# EAGLE design X14-Distribution (EAGLE 9.5.0)
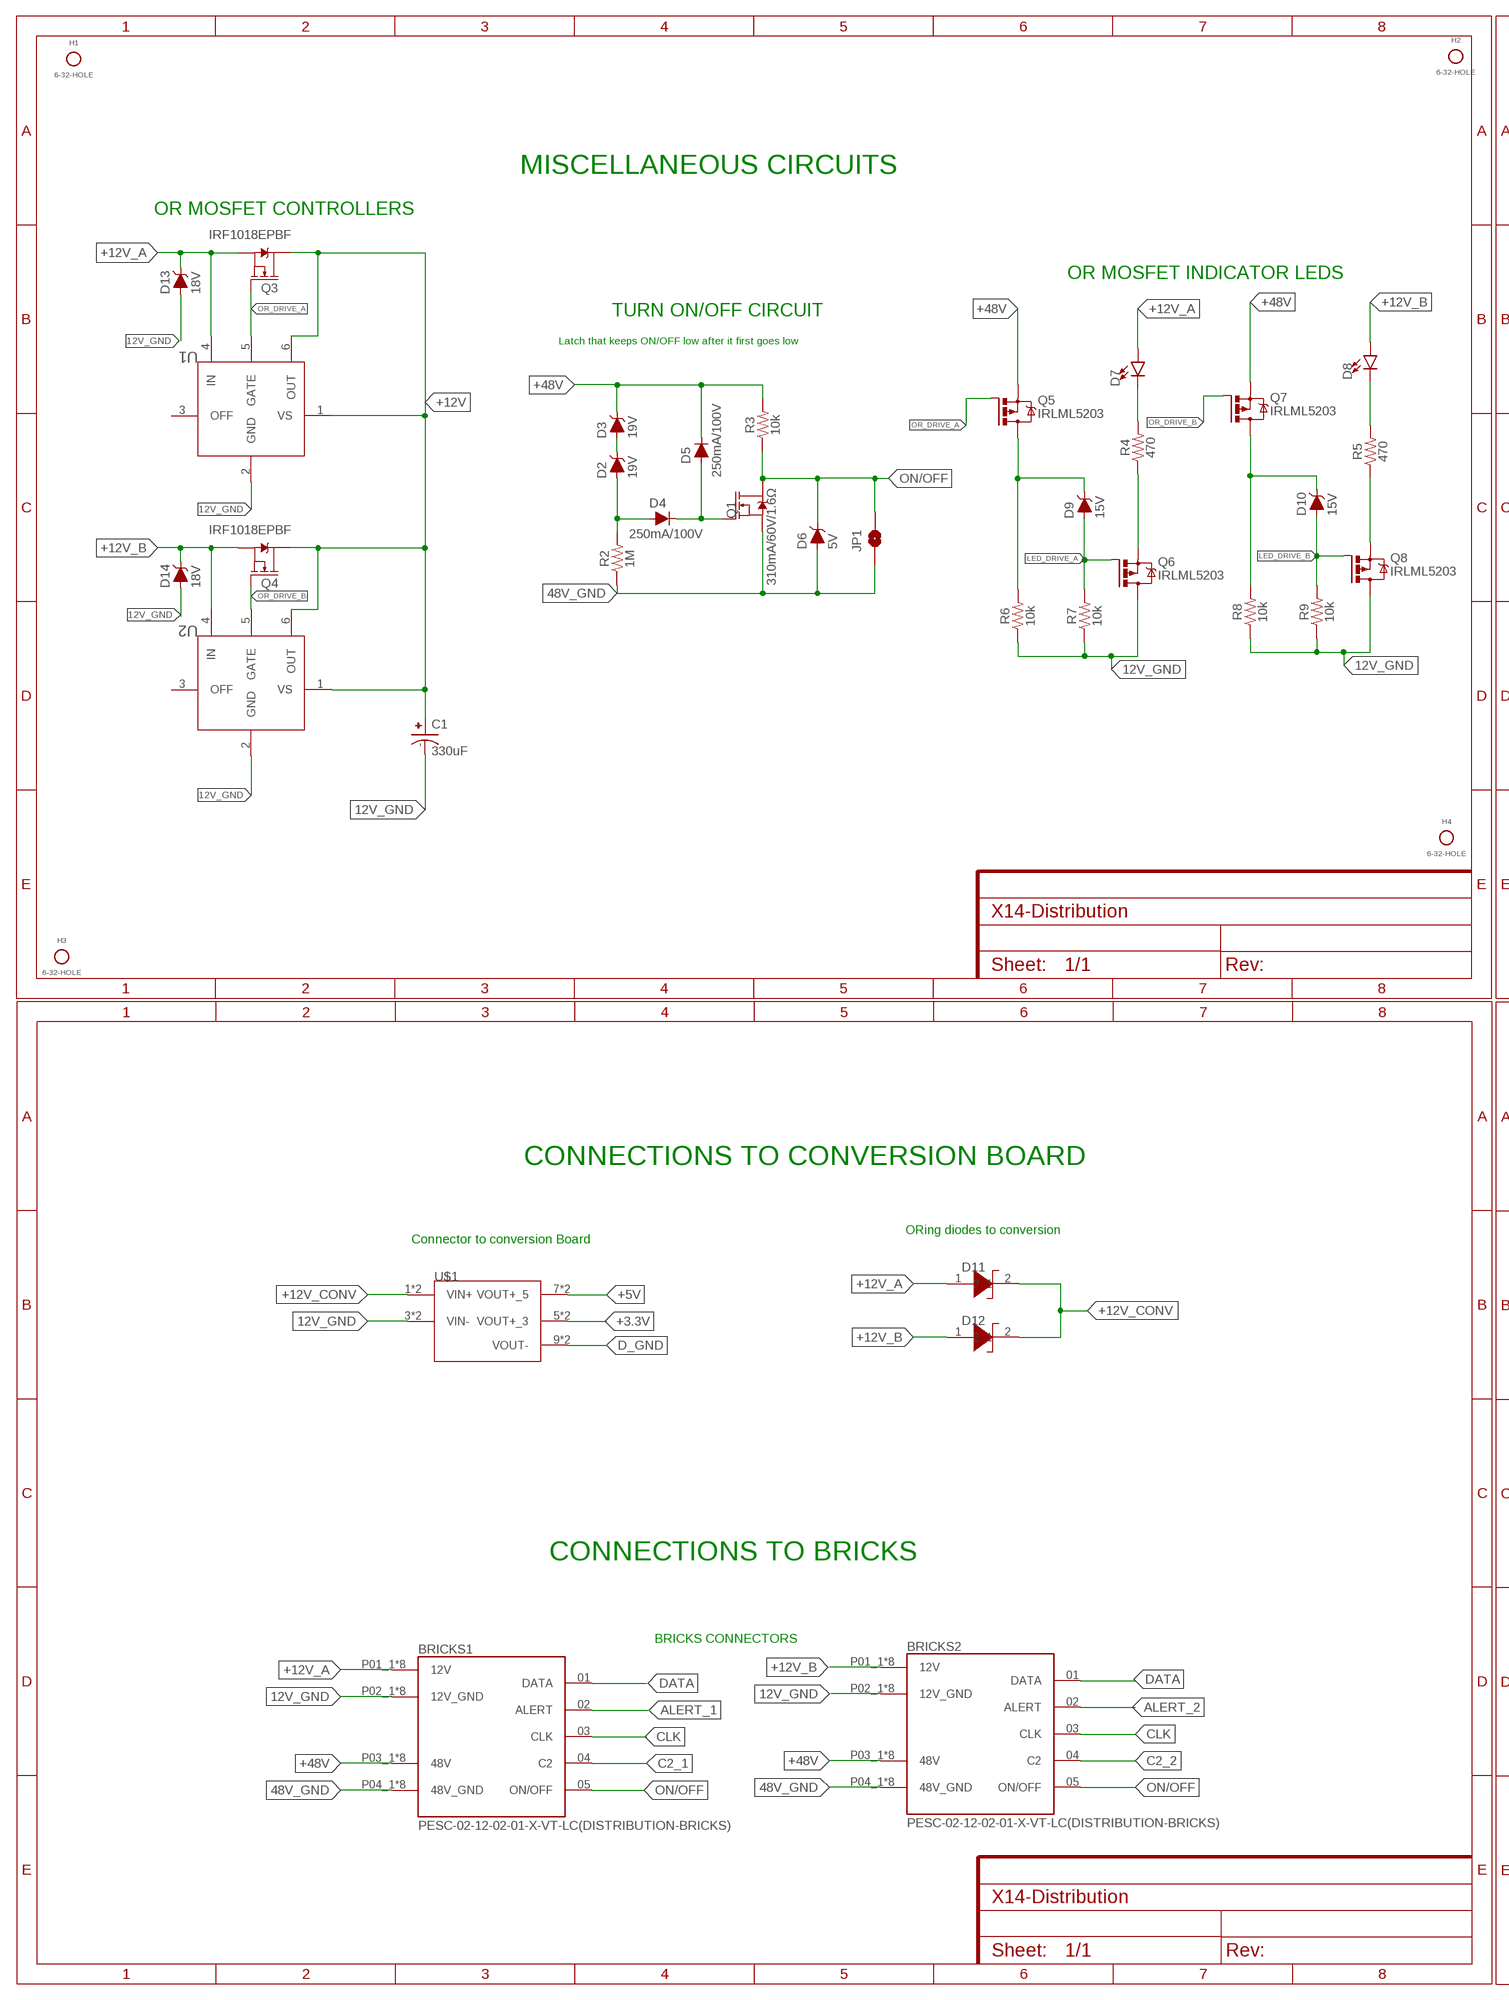
[diagram p0: schematic, sheet 1, part 1 of 2]
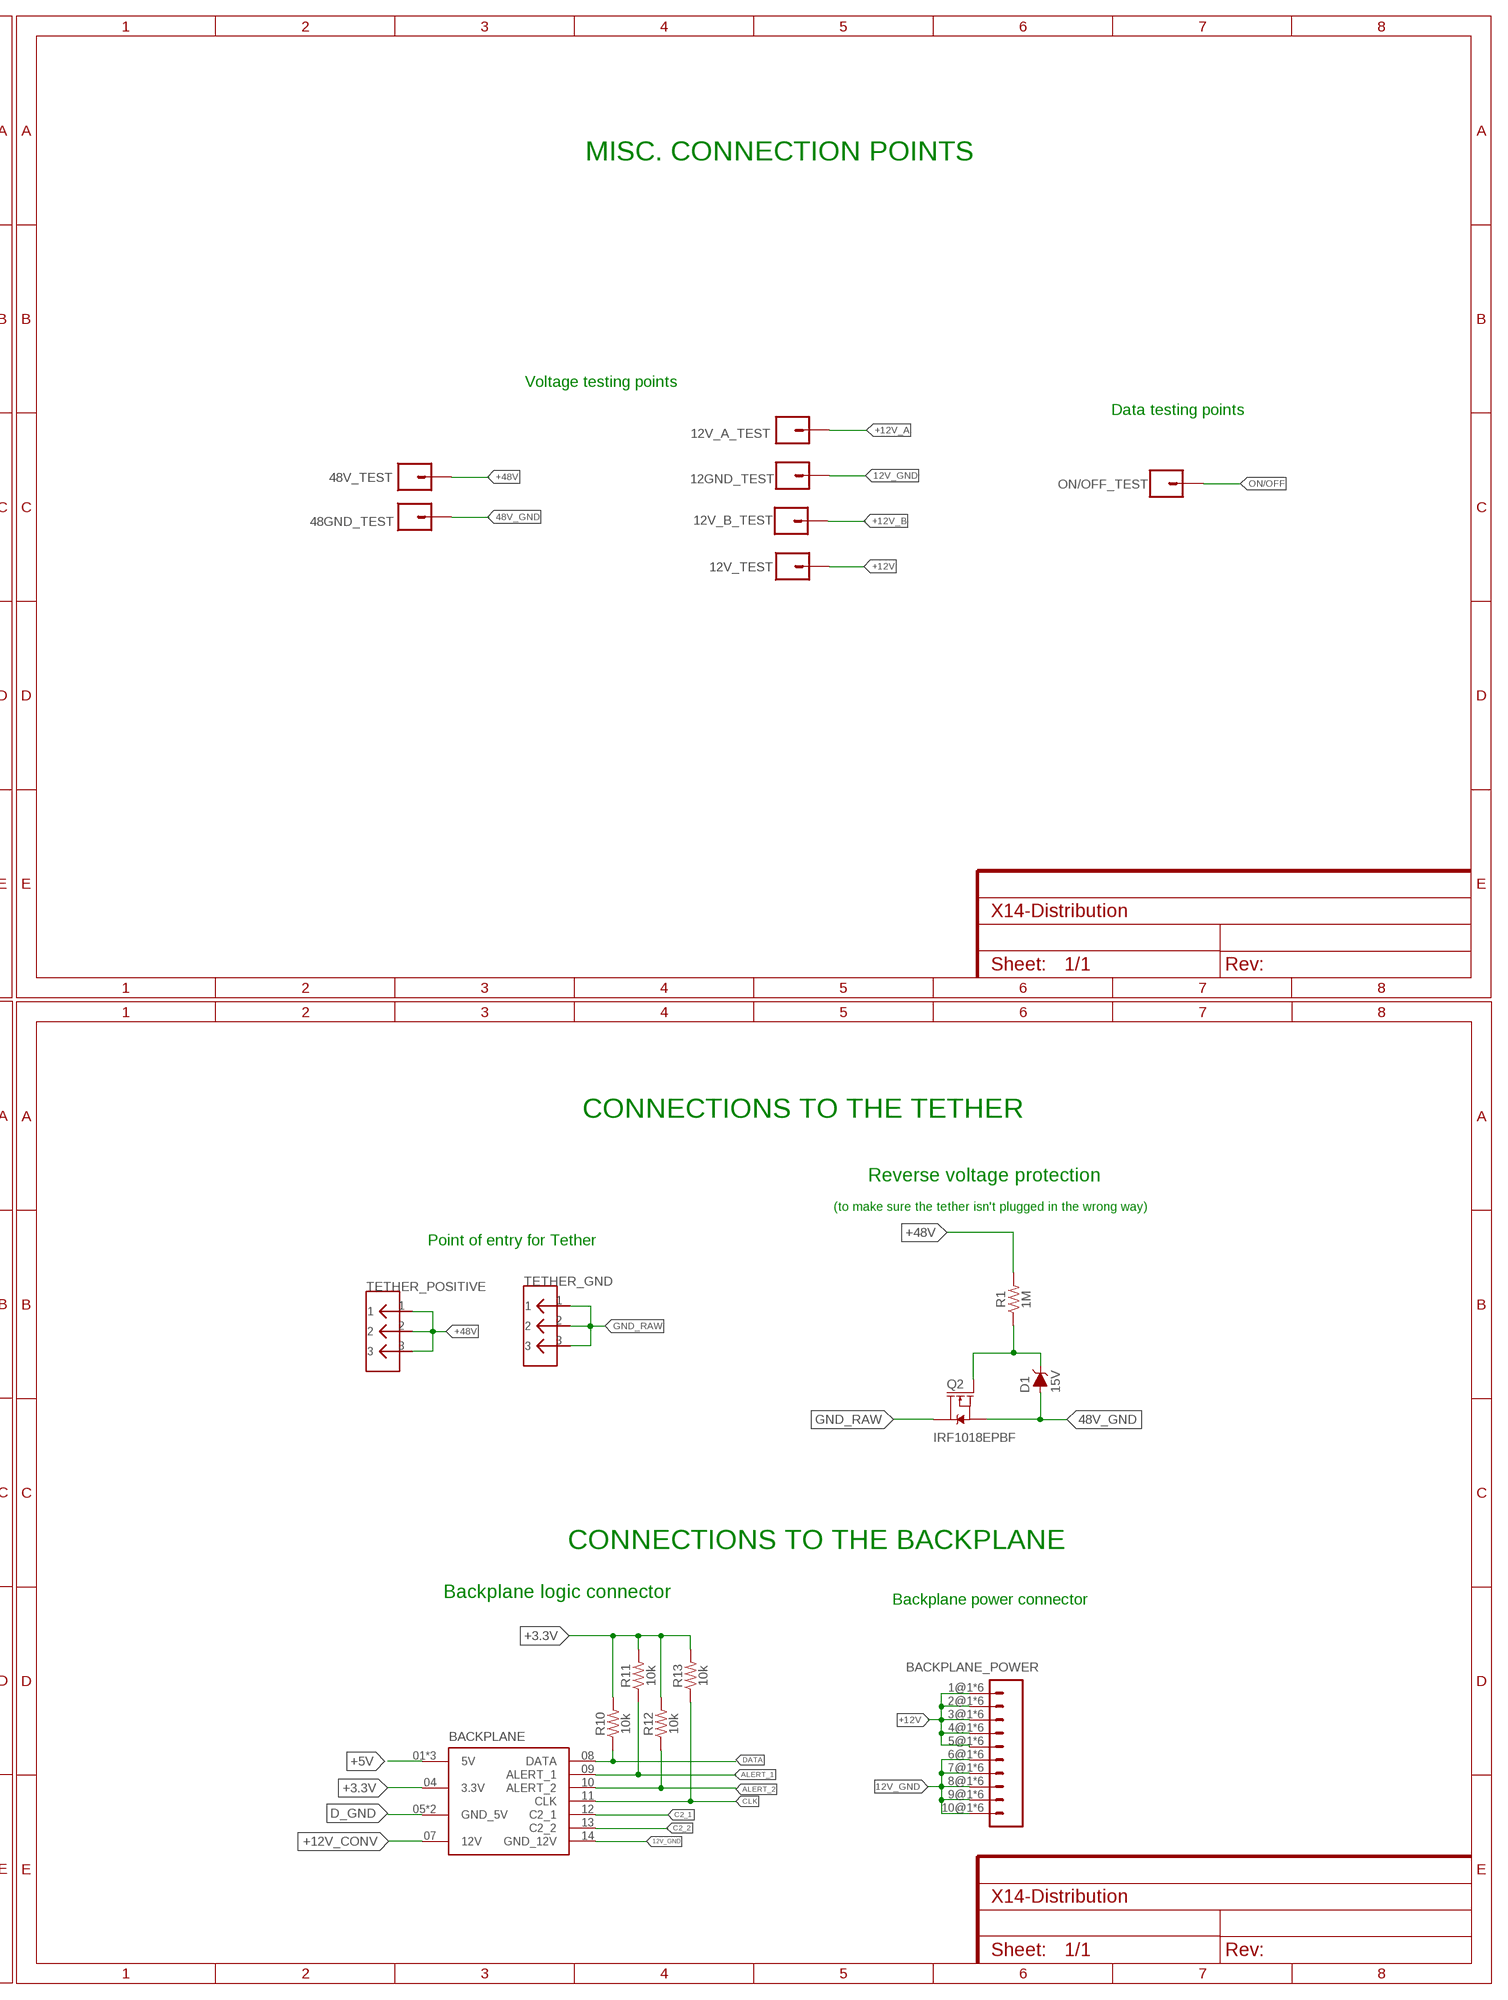
[diagram p1: schematic, sheet 1, part 2 of 2]

## Parts
12GND_TEST  CONN_01  [1X01]
12V_A_TEST  CONN_01  [1X01]
12V_B_TEST  CONN_01  [1X01]
12V_TEST  CONN_01  [1X01]
48GND_TEST  CONN_01  [1X01]
48V_TEST  CONN_01  [1X01]
BACKPLANE  DISTRIBUTION-BACKPLANE  [SAMTEC_IPL1-107-01-X-D-K(D-B)]
BACKPLANE_POWER  MPPT-10-01-01-L-RA-SD  [MPPT-10-01-01-L-RA-SD]
BRICKS1  PESC-02-12-02-01-X-VT-LC(DISTRIBUTION-BRICKS)  [SAMTEC_PESC-02-12-02-01-X-VT-LC(D-B)]
BRICKS2  PESC-02-12-02-01-X-VT-LC(DISTRIBUTION-BRICKS)  [SAMTEC_PESC-02-12-02-01-X-VT-LC(D-B)]
C1  330uF  UCM1H331MNL1GS  [CAPAE1030X1050N]
D1  15V  DIODE-ZENER-BZT52C3V6S  [SOD-323]
D2  19V  DIODE-ZENER-BZT52C3V6S  [SOD-323]
D3  19V  DIODE-ZENER-BZT52C3V6S  [SOD-323]
D4  250mA/100V  DIODE-BAS16J  [SOD-323]
D5  250mA/100V  DIODE-BAS16J  [SOD-323]
D6  5V  DIODE-ZENER-BZT52C3V6S  [SOD-323]
D7  LED0603  [LED-0603]
D8  LED0603  [LED-0603]
D9  15V  DIODE-ZENER-BZT52C3V6S  [SOD-323]
D10  15V  DIODE-ZENER-BZT52C3V6S  [SOD-323]
D11  DIODE-DO-214AC(SK34ATR)  [DIODE-DO-214AC(SK34ATR)]
D12  DIODE-DO-214AC(SK34ATR)  [DIODE-DO-214AC(SK34ATR)]
D13  18V  DIODE-ZENER-DZ2J150M0L  [PANASONIC_SMINI2-F5-B]
D14  18V  DIODE-ZENER-DZ2J150M0L  [PANASONIC_SMINI2-F5-B]
H1  6-32-HOLE  [6-32-HOLE]
H2  6-32-HOLE  [6-32-HOLE]
H3  6-32-HOLE  [6-32-HOLE]
H4  6-32-HOLE  [6-32-HOLE]
JP1  JUMPER-SMT_2_NO_SILK  [SMT-JUMPER_2_NO_SILK]
ON/OFF_TEST  CONN_01  [1X01]
Q1  310mA/60V/1.6Ω  MOSFET-NCH-2N7002PW  [SOT323]
Q2  IRF1018EPBF  [TO263]
Q3  IRF1018EPBF  [TO263]
Q4  IRF1018EPBF  [TO263]
Q5  IRLML5203  PMOSFET_IRLML5203  [SOT23]
Q6  IRLML5203  PMOSFET_IRLML5203  [SOT23]
Q7  IRLML5203  PMOSFET_IRLML5203  [SOT23]
Q8  IRLML5203  PMOSFET_IRLML5203  [SOT23]
R1  1M  RESISTOR0603  [0603]
R2  1M  RESISTOR0603  [0603]
R3  10k  RESISTOR0603  [0603]
R4  470  RESISTOR0603  [0603]
R5  470  RESISTOR0603  [0603]
R6  10k  RESISTOR0603  [0603]
R7  10k  RESISTOR0603  [0603]
R8  10k  RESISTOR0603  [0603]
R9  10k  RESISTOR0603  [0603]
R10  10k  RESISTOR0603  [0603]
R11  10k  RESISTOR0603  [0603]
R12  10k  RESISTOR0603  [0603]
R13  10k  RESISTOR0603  [0603]
TETHER_GND  796636-3  [796636-3]
TETHER_POSITIVE  796636-3  [796636-3]
U1  DIST_OR_CONTROL_ALTMK06A-M  [SOT-23-6]
U2  DIST_OR_CONTROL_ALTMK06A-M  [SOT-23-6]
U$1  DISTRIBUTION-CONVERSION  [TSW-105-05-G-S(D-C)]

## Nets
12V_GND: 12GND_TEST.1 BACKPLANE.14(GND_12V) BACKPLANE_POWER.6@1 BACKPLANE_POWER.6@2 BACKPLANE_POWER.6@3 BACKPLANE_POWER.6@4 BACKPLANE_POWER.6@5 BACKPLANE_POWER.6@6 BACKPLANE_POWER.7@1 BACKPLANE_POWER.7@2 BACKPLANE_POWER.7@3 BACKPLANE_POWER.7@4 BACKPLANE_POWER.7@5 BACKPLANE_POWER.7@6 BACKPLANE_POWER.8@1 BACKPLANE_POWER.8@2 BACKPLANE_POWER.8@3 BACKPLANE_POWER.8@4 BACKPLANE_POWER.8@5 BACKPLANE_POWER.8@6 BACKPLANE_POWER.9@1 BACKPLANE_POWER.9@2 BACKPLANE_POWER.9@3 BACKPLANE_POWER.9@4 BACKPLANE_POWER.9@5 BACKPLANE_POWER.9@6 BACKPLANE_POWER.10@1 BACKPLANE_POWER.10@2 BACKPLANE_POWER.10@3 BACKPLANE_POWER.10@4 BACKPLANE_POWER.10@5 BACKPLANE_POWER.10@6 BRICKS1.P02_1(12V_GND) BRICKS1.P02_2(12V_GND) BRICKS1.P02_3(12V_GND) BRICKS1.P02_4(12V_GND) BRICKS1.P02_5(12V_GND) BRICKS1.P02_6(12V_GND) BRICKS1.P02_7(12V_GND) BRICKS1.P02_8(12V_GND) BRICKS2.P02_1(12V_GND) BRICKS2.P02_2(12V_GND) BRICKS2.P02_3(12V_GND) BRICKS2.P02_4(12V_GND) BRICKS2.P02_5(12V_GND) BRICKS2.P02_6(12V_GND) BRICKS2.P02_7(12V_GND) BRICKS2.P02_8(12V_GND) C1.- D13.A D14.A Q6.3(D) Q8.3(D) R6.1 R7.1 R8.1 R9.1 U1.2(GND) U2.2(GND) U$1.3(VIN-) U$1.4(VIN-)
48V_GND: 48GND_TEST.1 BRICKS1.P04_1(48V_GND) BRICKS1.P04_2(48V_GND) BRICKS1.P04_3(48V_GND) BRICKS1.P04_4(48V_GND) BRICKS1.P04_5(48V_GND) BRICKS1.P04_6(48V_GND) BRICKS1.P04_7(48V_GND) BRICKS1.P04_8(48V_GND) BRICKS2.P04_1(48V_GND) BRICKS2.P04_2(48V_GND) BRICKS2.P04_3(48V_GND) BRICKS2.P04_4(48V_GND) BRICKS2.P04_5(48V_GND) BRICKS2.P04_6(48V_GND) BRICKS2.P04_7(48V_GND) BRICKS2.P04_8(48V_GND) D1.A D6.A JP1.1 Q1.2(S) Q2.2(S) R2.1
+3.3V: BACKPLANE.04(3.3V) R10.2 R11.2 R12.2 R13.2 U$1.5(VOUT+_3) U$1.6(VOUT+_3)
+5V: BACKPLANE.01(5V) BACKPLANE.02(5V) BACKPLANE.03(5V) U$1.7(VOUT+_5) U$1.8(VOUT+_5)
+12V: 12V_TEST.1 BACKPLANE_POWER.1@1 BACKPLANE_POWER.1@2 BACKPLANE_POWER.1@3 BACKPLANE_POWER.1@4 BACKPLANE_POWER.1@5 BACKPLANE_POWER.1@6 BACKPLANE_POWER.2@1 BACKPLANE_POWER.2@2 BACKPLANE_POWER.2@3 BACKPLANE_POWER.2@4 BACKPLANE_POWER.2@5 BACKPLANE_POWER.2@6 BACKPLANE_POWER.3@1 BACKPLANE_POWER.3@2 BACKPLANE_POWER.3@3 BACKPLANE_POWER.3@4 BACKPLANE_POWER.3@5 BACKPLANE_POWER.3@6 BACKPLANE_POWER.4@1 BACKPLANE_POWER.4@2 BACKPLANE_POWER.4@3 BACKPLANE_POWER.4@4 BACKPLANE_POWER.4@5 BACKPLANE_POWER.4@6 BACKPLANE_POWER.5@1 BACKPLANE_POWER.5@2 BACKPLANE_POWER.5@3 BACKPLANE_POWER.5@4 BACKPLANE_POWER.5@5 BACKPLANE_POWER.5@6 C1.+ Q3.3(D) Q4.3(D) U1.1(VS) U1.6(OUT) U2.1(VS) U2.6(OUT)
+12V_A: 12V_A_TEST.1 BRICKS1.P01_1(12V) BRICKS1.P01_2(12V) BRICKS1.P01_3(12V) BRICKS1.P01_4(12V) BRICKS1.P01_5(12V) BRICKS1.P01_6(12V) BRICKS1.P01_7(12V) BRICKS1.P01_8(12V) D7.A D11.1 D13.C Q3.2(S) U1.4(IN)
+12V_B: 12V_B_TEST.1 BRICKS2.P01_1(12V) BRICKS2.P01_2(12V) BRICKS2.P01_3(12V) BRICKS2.P01_4(12V) BRICKS2.P01_5(12V) BRICKS2.P01_6(12V) BRICKS2.P01_7(12V) BRICKS2.P01_8(12V) D8.A D12.1 D14.C Q4.2(S) U2.4(IN)
+12V_CONV: BACKPLANE.07(12V) D11.2 D12.2 U$1.1(VIN+) U$1.2(VIN+)
+48V: 48V_TEST.1 BRICKS1.P03_1(48V) BRICKS1.P03_2(48V) BRICKS1.P03_3(48V) BRICKS1.P03_4(48V) BRICKS1.P03_5(48V) BRICKS1.P03_6(48V) BRICKS1.P03_7(48V) BRICKS1.P03_8(48V) BRICKS2.P03_1(48V) BRICKS2.P03_2(48V) BRICKS2.P03_3(48V) BRICKS2.P03_4(48V) BRICKS2.P03_5(48V) BRICKS2.P03_6(48V) BRICKS2.P03_7(48V) BRICKS2.P03_8(48V) D3.C D5.C Q5.2(S) Q7.2(S) R1.2 R3.2 TETHER_POSITIVE.1 TETHER_POSITIVE.2 TETHER_POSITIVE.3
ALERT_1: BACKPLANE.09(ALERT_1) BRICKS1.02(ALERT) R11.1
ALERT_2: BACKPLANE.10(ALERT_2) BRICKS2.02(ALERT) R12.1
C2_1: BACKPLANE.12(C2_1) BRICKS1.04(C2)
C2_2: BACKPLANE.13(C2_2) BRICKS2.04(C2)
CLK: BACKPLANE.11(CLK) BRICKS1.03(CLK) BRICKS2.03(CLK) R13.1
D_GND: BACKPLANE.05(GND_5V) BACKPLANE.06(GND_5V) U$1.9(VOUT-) U$1.10(VOUT-)
DATA: BACKPLANE.08(DATA) BRICKS1.01(DATA) BRICKS2.01(DATA) R10.1
GND_RAW: Q2.3(D) TETHER_GND.1 TETHER_GND.2 TETHER_GND.3
LED_DRIVE_A: D9.A Q6.1(G) R7.2
LED_DRIVE_B: D10.A Q8.1(G) R9.2
N$1: D1.C Q2.1(G) R1.1
N$2: D4.C D5.A Q1.1(G)
N$3: Q6.2(S) R4.1
N$4: D2.C D3.A
N$5: D9.C Q5.3(D) R6.2
N$6: D2.A D4.A R2.2
N$7: Q8.2(S) R5.1
N$11: D10.C Q7.3(D) R8.2
N$13: D7.C R4.2
N$15: D8.C R5.2
ON/OFF: BRICKS1.05(ON/OFF) BRICKS2.05(ON/OFF) D6.C JP1.2 ON/OFF_TEST.1 Q1.3(D) R3.1
OR_DRIVE_A: Q3.1(G) Q5.1(G) U1.5(GATE)
OR_DRIVE_B: Q4.1(G) Q7.1(G) U2.5(GATE)
Unconnected: U1.3(OFF) U2.3(OFF)

## Notes on the sheet
- MISC. CONNECTION POINTS
- MISCELLANEOUS CIRCUITS
- OR MOSFET CONTROLLERS
- OR MOSFET INDICATOR LEDS
- TURN ON/OFF CIRCUIT
- Latch that keeps ON/OFF low after it first goes low
- Voltage testing points
- Data testing points
- CONNECTIONS TO THE TETHER
- CONNECTIONS TO CONVERSION BOARD
- Reverse voltage protection
- (to make sure the tether isn't plugged in the wrong way)
- ORing diodes to conversion
- Connector to conversion Board | Point of entry for Tether
- CONNECTIONS TO THE BACKPLANE
- CONNECTIONS TO BRICKS
- Backplane logic connector
- Backplane power connector
- BRICKS CONNECTORS

## Library data of the parts
12GND_TEST 12V_A_TEST 12V_B_TEST 12V_TEST 48GND_TEST 48V_TEST ON/OFF_TEST = SparkFun-Connectors:CONN_01: Single connection point. Often used as Generic Header-pin footprint for 0.1 inch spaced/style header connections On any of the 0.1 inch spaced packages, you can populate with these: Break Away Headers - Straight <https://www.sparkfun.com/products/116> (PRT-00116) Break Away Male Headers - Right Angle <https://www.sparkfun.com/products/553> (PRT-00553) Female Headers <https://www.sparkfun.com/products/115> (PRT-00115) Break Away Headers - Machine Pin <https://www.sparkfun.com/products/117> (PRT-00117) Break Away Female Headers - Swiss Machine Pin <https://www.sparkfun.com/products/743> (PRT-00743) This device is also useful as a general connection point to wire up your design to another part of your project. Our various solder wires solder well into these plated through hole pads. Hook-Up Wire - Assortment (Stranded, 22 AWG) <https://www.sparkfun.com/products/11375> (PRT-11375) Hook-Up Wire - Assortment (Solid Core, 22 AWG) <https://www.sparkfun.com/products/11367> (PRT-11367) View the entire wire category on our website here <https://www.sparkfun.com/categories/141> Special notes: SMTSO-256-ET is a "flush mount" nut for a 4-40 screw. We mostly use this on specialty testbeds; it is a nice way to connect hardware to your PCB at an adjustable hieght. Also note, the SNAP packages are for using a snappable style connector. We sell a baggie of snaps and they are also used on two LilyPad designs: Snap Assortment - 30 pack (male and female) <https://www.sparkfun.com/products/11347> (DEV-11347) LilyPad Arduino SimpleSnap <https://www.sparkfun.com/products/10941> (DEV-10941) LilyPad SimpleSnap Protoboard <https://www.sparkfun.com/products/10940> (DEV-10940)
BACKPLANE = CONN, Distribution-Backplane:DISTRIBUTION-BACKPLANE
BACKPLANE_POWER = CONN, Samtec MPPT Hermaphoditic 10 pos - MPPT-10-01-01-L-RA-SD:MPPT-10-01-01-L-RA-SD: Samtec MPPT Connector Right Angle Vertically mating Non-gendered https://www.samtec.com/products/mppt-10-01-01-l-ra-sd
BRICKS1 BRICKS2 = CONN, Distribution-Bricks:PESC-02-12-02-01-X-VT-LC(DISTRIBUTION-BRICKS): 16 (12 + 4 Power) Position Receptacle Connector Through Hole Gold; MANUFACTURER: Samtec; MAXIMUM_PACKAGE_HEIGHT: 17.04mm; PARTREV: B; STANDARD: Manufacturer Recommendations
C1 = CAP, aluminin-capacitor-brick-UCM1H331MNL1GS:UCM1H331MNL1GS: Nichicon 330uF 50 V Aluminium Electrolytic Capacitor SMD, CM Series 2000h 10 (Dia.) x 10mm Source: Datasheet <http://www.nichicon.co.jp/english/products/pdfs/e-ucm.pdf>; ARROW_PART_NUMBER: UCM1H331MNL1GS; ARROW_PRICE-STOCK: https://www.arrow.com/en/products/ucm1h331mnl1gs/nichicon; DESCRIPTION: Nichicon 330uF 50 V Aluminium Electrolytic Capacitor SMD, CM Series 2000h 10 (Dia.) x 10mm; HEIGHT: 10.5mm; MANUFACTURER_NAME: Nichicon; MANUFACTURER_PART_NUMBER: UCM1H331MNL1GS; MOUSER_PART_NUMBER: 647-UCM1H331MNL1GS; MOUSER_PRICE-STOCK: https://www.mouser.co.uk/ProductDetail/Nichicon/UCM1H331MNL1GS?qs=DSgADHjnLTkTovFLdbC%252BNg%3D%3D
D1-D3 D6 D9 D10 = SparkFun-DiscreteSemi:DIODE-ZENER: Zener Diode A Zener diode allows current to flow from its anode to its cathode like a normal semiconductor diode, but it also permits current to flow in the reverse direction when its "Zener voltage" is reached. - WIkipedia; PROD_ID: DIO-08199; VALUE: 3.6V
D4 D5 = SparkFun-DiscreteSemi:DIODE: Diode These are standard reverse protection diodes and small signal diodes. SparkFun Products: SparkFun SparkPunk Sound Kit <https://www.sparkfun.com/products/11177> SparkFun ESP8266 Thing <https://www.sparkfun.com/products/13231>; PROD_ID: DIO-09646
D7 D8 = SparkFun-LED:LED: LED (Generic) Standard schematic elements and footprints for 5mm, 3mm, 1206, and 0603 sized LEDs. Generic LEDs with no color specified.
D11 D12 = DIODE, Dist Oring Schottky Diode:DIODE-DO-214AC(SK34ATR)
D13 D14 = SparkFun-DiscreteSemi:DIODE-ZENER: Zener Diode A Zener diode allows current to flow from its anode to its cathode like a normal semiconductor diode, but it also permits current to flow in the reverse direction when its "Zener voltage" is reached. - WIkipedia; PROD_ID: DIO-12989; VALUE: 15V
H1-H4 = OTHER, Mounting Holes:6-32-HOLE
JP1 = SparkFun-Jumpers:JUMPER-SMT_2_NO: Normally open jumper This jumper has two pads in close proximity to each other. Apply solder to close the connection. Round pads are easier to solder for beginners, but are a lot larger. SparkFun Product that uses the round pads: SparkFun EL Sequencer <https://www.sparkfun.com/products/12781>
Q1 = SparkFun-DiscreteSemi:MOSFET-NCH: N-channel MOSFETs Voltage controlled devices that allow control of high current outputs. SparkFun Products: SparkFun OpenScale <https://www.sparkfun.com/products/13261> SparkFun Digital Sandbox <https://www.sparkfun.com/products/12651> SparkFun Monster Moto Shield <https://www.sparkfun.com/products/10182> SparkFun MOSFET Power Controller <https://www.sparkfun.com/products/11214>; PROD_ID: TRANS-11151
Q2-Q4 = TRANS, Dist_Reverse_Voltage_NMOS:IRF1018EPBF
Q5-Q8 = Transistor:PMOSFET_: P-Channel MOSFET - Popular parts; CATEGORY: Transistor; DESCRIPTION: MOSFET P-CH 30V 3A SOT-23; DRAIN_CURRENT: 3A; MANUFACTURER: Infineon Technologies; MPN: IRLML5203TRPBF; OPERATING_TEMP: -55°C ~ 150°C; PART_STATUS: Active; ROHS_COMPLIANT: Yes; SUB-CATEGORY: MOSFET; THERMALLOSS: 1.25W; TYPE: P-Channel
R1-R13 = SparkFun-Resistors:RESISTOR: Generic Resistor Package
TETHER_GND TETHER_POSITIVE = CONN, 3 pin connection to tether:796636-3
U1 U2 = IC, Dist_OR_Controller:DIST_OR_CONTROL_ALT; BASEPN: LM5050-1; DATASHEETURL: http://www.ti.com/lit/ds/symlink/lm5050-1.pdf; DESCRIPTION: High Side OR-ing FET Controller; MANUFACTURER: Texas Instruments; MANUFACTURER_PART_NUMBER: LM5050MK-1/NOPB; NSC_PACKAGEREFERENCE: MK06A; VENDOR: Texas Instruments
U$1 = CONN, Distribution-Conversion:DISTRIBUTION-CONVERSION

## Board
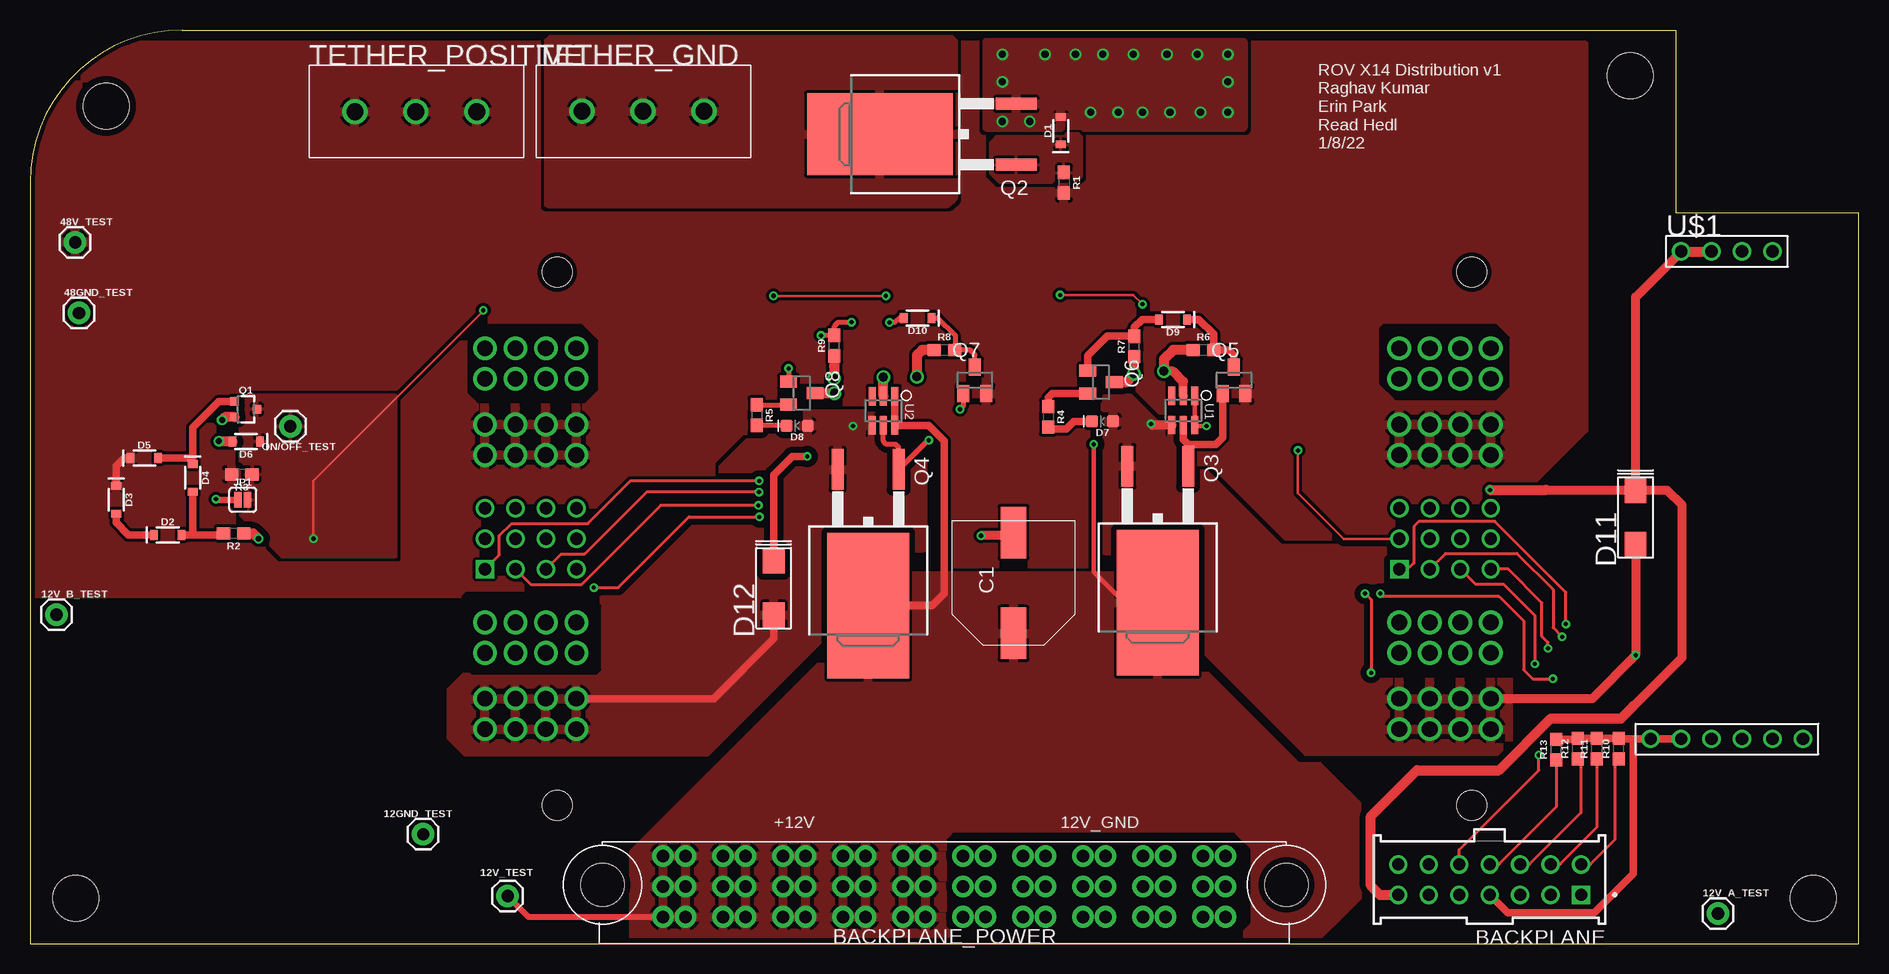
[diagram p2: board, top side]
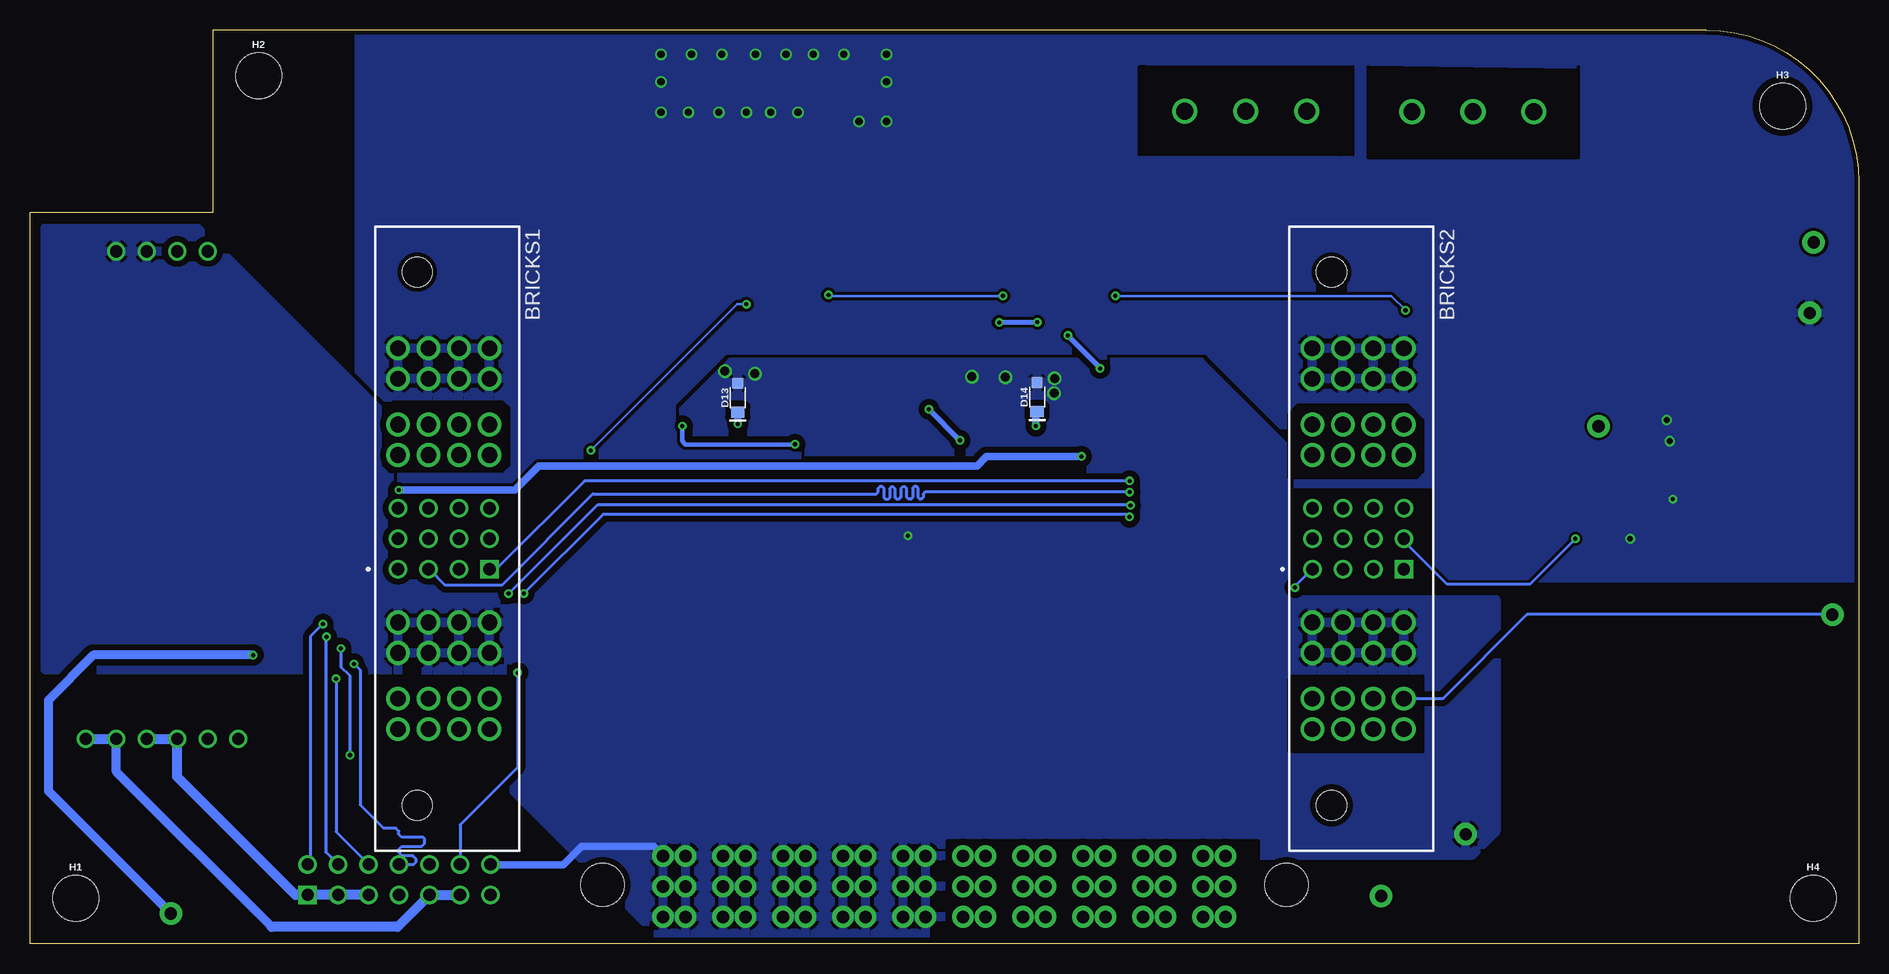
[diagram p3: board, bottom side, seen from below]

Size 152.4 x 76.2 mm. Coordinates in mm from the lower left corner, seen from the top.
Outline: 0,0 152.4,0 152.4,60.96 137.16,60.96 137.16,76.2 12.7,76.2 arc90 0,63.5 0,0
Copper layers (1*16): Top 0.0356mm / dielectric 1.5011mm / Bottom 0.0356mm
Design rules "ECE_Senior_Design": minimum track width 8mil, minimum drill 13mil, track to track 8mil, track to pad 8mil, pad to pad 6mil, via to via 8mil, smd to smd 6mil, copper to edge 15mil, drill to drill 8mil, minimum pad ring 7mil, minimum via ring 7mil, stop-mask expansion 3mil, vias tented up to drill 0mil, thermal gap 10mil

### Footprints (pad centres in the part's own frame; a part is rotated, then mirrored left to right if it is on the bottom)
1X01 = drill 1.016 pad 1.88: 1 0,0
SAMTEC_IPL1-107-01-X-D-K(D-B) = drill 1.02 square: 01 -7.62,1.27 | drill 1.02: 02 -5.08,1.27; 03 -2.54,1.27; 04 0,1.27; 05 2.54,1.27; 06 5.08,1.27; 07 7.62,1.27; 08 -7.62,-1.27; 09 -5.08,-1.27; 10 -2.54,-1.27; 11 0,-1.27; 12 2.54,-1.27; 13 5.08,-1.27; 14 7.62,-1.27
MPPT-10-01-01-L-RA-SD = drill 1.04 pad 1.8: 1@1 -23.44,2.26; 1@2 -21.56,2.26; 1@3 -23.44,4.8; 1@4 -21.56,4.8; 1@5 -23.44,7.34; 1@6 -21.56,7.34; 2@1 -18.44,2.26; 2@2 -16.56,2.26; 2@3 -18.44,4.8; 2@4 -16.56,4.8; 2@5 -18.44,7.34; 2@6 -16.56,7.34; 3@1 -13.44,2.26; 3@2 -11.56,2.26; 3@3 -13.44,4.8; 3@4 -11.56,4.8; 3@5 -13.44,7.34; 3@6 -11.56,7.34; 4@1 -8.44,2.26; 4@2 -6.56,2.26; 4@3 -8.44,4.8; 4@4 -6.56,4.8; 4@5 -8.44,7.34; 4@6 -6.56,7.34; 5@1 -3.44,2.26; 5@2 -1.56,2.26; 5@3 -3.44,4.8; 5@4 -1.56,4.8; 5@5 -3.44,7.34; 5@6 -1.56,7.34; 6@1 1.56,2.26; 6@2 3.44,2.26; 6@3 1.56,4.8; 6@4 3.44,4.8; 6@5 1.56,7.34; 6@6 3.44,7.34; 7@1 6.56,2.26; 7@2 8.44,2.26; 7@3 6.56,4.8; 7@4 8.44,4.8; 7@5 6.56,7.34; 7@6 8.44,7.34; 8@1 11.56,2.26; 8@2 13.44,2.26; 8@3 11.56,4.8; 8@4 13.44,4.8; 8@5 11.56,7.34; 8@6 13.44,7.34; 9@1 16.56,2.26; 9@2 18.44,2.26; 9@3 16.56,4.8; 9@4 18.44,4.8; 9@5 16.56,7.34; 9@6 18.44,7.34; 10@1 21.56,2.26; 10@2 23.44,2.26; 10@3 21.56,4.8; 10@4 23.44,4.8; 10@5 21.56,7.34; 10@6 23.44,7.34 | hole 3.6: 28.5,4.93; -28.5,4.93
SAMTEC_PESC-02-12-02-01-X-VT-LC(D-B) = drill 1.02 square: 01 2.54,6.03 | drill 1.02: 02 2.54,3.49; 03 2.54,0.95; 04 2.54,-1.59; 05 0,6.03; 06 0,3.49; 07 0,0.95; 08 0,-1.59; 09 -2.54,6.03; 10 -2.54,3.49; 11 -2.54,0.95; 12 -2.54,-1.59 | drill 1.32: P01_1 15.875,-1.59; P01_2 15.875,0.95; P01_3 15.875,3.49; P01_4 15.875,6.03; P01_5 13.335,-1.59; P01_6 13.335,0.95; P01_7 13.335,3.49; P01_8 13.335,6.03; P02_1 9.525,-1.59; P02_2 9.525,0.95; P02_3 9.525,3.49; P02_4 9.525,6.03; P02_5 6.985,-1.59; P02_6 6.985,0.95; P02_7 6.985,3.49; P02_8 6.985,6.03; P03_1 -6.985,-1.59; P03_2 -6.985,0.95; P03_3 -6.985,3.49; P03_4 -6.985,6.03; P03_5 -9.525,-1.59; P03_6 -9.525,0.95; P03_7 -9.525,3.49; P03_8 -9.525,6.03; P04_1 -13.335,-1.59; P04_2 -13.335,0.95; P04_3 -13.335,3.49; P04_4 -13.335,6.03; P04_5 -15.875,-1.59; P04_6 -15.875,0.95; P04_7 -15.875,3.49; P04_8 -15.875,6.03 | hole 2.49: -22.225,0; 22.225,0
CAPAE1030X1050N = smd 4.3 x 2.15: + -4.2,0; - 4.2,0
SOD-323 = smd 0.63 x 0.83: A 1.15,0; C -1.15,0
LED-0603 = smd 1 x 1: A -0.877,0; C 0.877,0
DIODE-DO-214AC(SK34ATR) = smd 2.1 x 1.8: 1 -2.3,0; 2 2.2,0
PANASONIC_SMINI2-F5-B = smd 0.9 x 0.9: A 1.2,0 | smd 0.9 x 1.1: C -1.2,0
6-32-HOLE = hole 3.81: 0,0
SMT-JUMPER_2_NO_SILK = smd 0.635 x 1.27: 1 -0.406,0; 2 0.406,0
SOT323 = smd 0.7 x 0.7: 1 -0.65,-0.925; 2 0.65,-0.925; 3 0,0.925
TO263 = smd 3.4 x 1: 1 -6.552,2.54; 2 -6.552,-2.54 | smd 12.14 x 6.8: 3 4.818,0
SOT23 = smd 1 x 1.4: 1 -0.95,-1.1; 2 0.95,-1.1; 3 0,1.1
0603 = smd 1.1 x 1: 1 -0.85,0; 2 0.85,0
796636-3 = drill 1.4: 1 -5.08,0; 2 0,0; 3 5.08,0
SOT-23-6 = smd 1.524 x 0.584: 1 -1.219,0.95; 2 -1.219,0; 3 -1.219,-0.95; 4 1.219,-0.95; 5 1.219,0; 6 1.219,0.95
TSW-105-05-G-S(D-C) = drill 1.016: 1 -3.81,20.32; 2 -1.27,20.32; 3 1.27,20.32; 4 3.81,20.32; 5 -6.35,-20.32; 6 -3.81,-20.32; 7 -1.27,-20.32; 8 1.27,-20.32; 9 3.81,-20.32; 10 6.35,-20.32

### Placement (x,y rotation side)
12GND_TEST  32.77,9.14 0 top
12V_A_TEST  140.67,2.54 0 top
12V_B_TEST  2.21,27.46 0 top
12V_TEST  39.8,3.99 0 top
48GND_TEST  4.09,52.6 0 top
48V_TEST  3.76,58.5 0 top
BACKPLANE  121.64,5.36 180 top
BACKPLANE_POWER  76.2,0 0 top
BRICKS1  120.14,33.78 270 bottom
BRICKS2  43.94,33.78 270 bottom
C1  81.97,30.1 90 top
D1  85.9,67.79 90 top
D2  11.48,34.11 0 top
D3  7.19,37.03 270 top
D4  13.56,38.86 270 top
D5  9.53,40.51 0 top
D6  18.01,41.88 180 top
D7  89.38,43.56 180 top
D8  63.93,43.21 180 top
D9  95.25,52.07 180 top
D10  73.96,52.2 180 top
D11  133.81,35.61 90 top
D12  61.98,29.72 90 top
D13  93.42,45.54 90 bottom
D14  68.48,45.59 90 bottom
H1  148.59,3.81 0 bottom
H2  133.35,72.39 0 bottom
H3  6.35,69.85 0 bottom
H4  3.81,3.81 0 bottom
JP1  17.73,37.03 0 top
ON/OFF_TEST  21.69,43.15 180 top
Q1  17.98,44.58 270 top
Q2  75.64,67.51 180 top
Q3  93.98,33.27 270 top
Q4  69.85,33.02 270 top
Q5  100.33,46.99 0 top
Q6  89.26,46.84 270 top
Q7  78.74,46.99 0 top
Q8  64.31,45.92 270 top
R1  86.16,63.47 270 top
R2  16.97,34.24 180 top
R3  17.65,39.14 180 top
R4  84.84,43.94 270 top
R5  60.55,44.09 270 top
R6  97.79,49.53 0 top
R7  92.02,49.81 90 top
R8  76.2,49.53 0 top
R9  67.03,49.89 90 top
R10  132.41,16.28 90 top
R11  130.58,16.28 90 top
R12  128.98,16.28 90 top
R13  127.2,16.21 90 top
TETHER_GND  51.08,69.42 0 top
TETHER_POSITIVE  32.16,69.39 0 top
U1  96.11,44.48 270 top
U2  71.12,44.45 270 top
U$1  141.4,37.41 0 top

### Tracks (layer width: path | path; a pad name or v marks a point on that pad's centre or on a via)
12V_GND  (via drill 0.35, 0.75)
  Top 0.61: 67.03,48.18 67,48.16
  Top 0.762: C1.- 81.7,34.04 v79.25,34.04 | U1.2 96.11,46.89 95.25,47.75 v94.49,47.75
  Top 0.813: Q8.3 v67.06,45.92 | R9.1 67.03,48.18 | 67,48.16 v67,47.14 | R8.1 74.33,49.53 73.91,49.11 v73.91,47.3 | U2.2 v71.12,47.24 | R7.1 92,48.93 v92,47.55 92,47.5 91.34,46.84 Q6.3 | R6.1 95.25,49.53 94.49,48.77 v94.49,47.75
  Bottom 0.61: BACKPLANE.14 114,6.6 107.95,6.6 106.43,8.13 100.43,8.13 BACKPLANE_POWER.10@6
  pour Bottom (isolate 0.508, rank 3): 30.23,28.7 30.23,9.4 32.26,7.37 76.2,7.37 76.2,0 99.36,0 119.38,20.02 119.38,23.11 93.98,48.51 54.86,48.51 47.75,41.4 47.75,28.7
  pour Bottom (isolate 0.508, rank 3): 109.86,31.11 118.11,22.86 151.13,22.86 151.13,59.69 138.43,59.69
48V_GND  (via drill 0.35, 0.45, 0.5, 0.6)
  Top 0.559: JP1.1 15.54,37.03 v15.49,37.08
  Top 0.813: R2.1 18.59,34.24 v19.05,33.78 | D6.A 15.77,41.88 v15.75,41.91 | Q1.2 16.24,43.93 v16,43.69
  other vias: 81.03,68.58 88.39,69.34 81.03,71.88 83.31,68.58 81.03,74.17 84.58,74.17 87.12,74.17 89.41,74.17 90.68,69.34 91.95,74.17 92.71,69.34 95,69.34 94.74,74.17 97.28,74.17 97.54,69.34 99.82,69.34 99.82,74.17 99.82,71.88
  pour Bottom (isolate 0.254, rank 5): 0,76.96 0,38.35 124.97,38.35 124.97,76.96
  pour Bottom (rank 3): 32.51,52.83 0,52.83 0,30.23 35.31,30.23 35.31,50.04
  pour Top (rank 2): 79.76,68.07 79.76,75.18 101.09,75.18 101.09,68.07
+3.3V
  Top 0.61: BACKPLANE.04 123.14,2.59 130.35,2.59 133.6,5.84 133.6,17.09 | U$1.6 U$1.5 133.6,17.09 | 133.6,17.09 132.45,17.09 R10.2 R11.2 R12.2 128.91,17.05 R13.2
+5V
  Bottom 0.813: BACKPLANE.03 BACKPLANE.01 | BACKPLANE.01 130.28,4.09 140.13,13.95 U$1.7 U$1.8 | BACKPLANE.02 BACKPLANE.01
+12V  (via drill 0.35)
  Top 0.381: U1.1 U1.6 97.14,43.18 v98.04,43.18 | Q3.3 91.19,28.46 88.65,31 v88.65,41.66
  Top 0.508: 12V_TEST.1 41.53,2.26 BACKPLANE_POWER.1@1
  Top 0.61: U2.1 U2.6 74.88,43.23 76.2,41.91 76.2,29.22 75.18,28.2 Q4.3
  Bottom 0.381: v98.04,43.18 98.04,41.91 97.79,41.66 v88.65,41.66
  pour Top (isolate 0.508, rank 4): 50.29,-1.27 50.29,7.62 73.41,30.73 91.44,30.73 111.25,10.92 111.25,4.57 105.41,-1.27
+12V_A  (via drill 0.35)
  Top 0.762: D11.1 v133.81,24.08 130.18,20.45 BRICKS1.P01_5 | U1.4 93.52,43.26 v93.42,43.36
  Bottom 0.61: D13.C v93.42,43.36
  Bottom 0.762: v133.81,24.08 147.12,24.08 150.88,20.32 150.88,12.75 12V_A_TEST.1
  pour Top (isolate 0.508, rank 3): 83.82,38.61 83.82,45.72 91.44,45.72 104.14,33.02 123.19,33.02 123.19,16 106.43,16
+12V_B  (via drill 0.35)
  Top 0.61: D12.1 61.98,25.46 56.96,20.45 BRICKS2.P01_5
  Bottom 0.254: 12V_B_TEST.1 27.66,27.46 34.67,20.45 BRICKS2.P01_8
  Bottom 0.61: D14.C 68.58,44.29 v68.58,43.18
  pour Top (isolate 0.508, rank 2): 35.05,17.27 36.32,16 56.39,16 73.41,33.02 74.42,33.02 74.42,44.2 62.23,44.2 47.75,29.72 47.75,22.35 36.32,22.35 35.05,21.08
+12V_CONV  (via drill 0.35)
  Top 0.61: v64.77,40.64 63.5,40.64 61.98,39.12 D12.2
  Top 0.762: 126.34,37.85 133.77,37.85 D11.2 | D11.2 133.81,53.95 U$1.1 | 133.6,19.81 137.67,23.88 137.67,36.58 136.43,37.81 D11.2
  Top 0.813: BACKPLANE.07 112.5,4.09 111.73,4.85 111.73,10.64 115.57,14.48 122.43,14.48 126.75,18.8 132.59,18.8 133.6,19.81 | U$1.1 U$1.2 | v121.67,37.85 126.34,37.85
  Bottom 0.61: v64.77,40.64 72.69,40.64 73.48,39.85 110.01,39.85 112.01,37.85 v121.67,37.85
+48V
  Top 0.61: D5.C 7.87,40.51 7.19,39.83 D3.C
  pour Top (isolate 0.254, rank 5): -0.25,29.21 115.82,29.21 129.54,42.93 129.54,74.93 -0.25,74.93
ALERT_1  (via drill 0.35)
  Top 0.254: R11.1 130.58,9.73 127.48,6.63 BACKPLANE.09 | v127.69,25.6 126.92,26.37 126.92,29.54 123.9,32.57 117.98,32.57 BRICKS1.02
  Bottom 0.254: BACKPLANE.09 127.76,7.67 127.76,25.53 v127.69,25.6
ALERT_2  (via drill 0.35)
  Top 0.254: R12.1 129.24,15.18 129.24,10.92 124.94,6.63 BACKPLANE.10 | BRICKS2.02 41.72,29.97 45.97,29.97 52.56,36.56 v60.7,36.56 | v112.52,29.21 112.78,28.96 122.43,28.96 124.46,26.92 124.46,22.86 125.22,22.1 v126.9,22.1
  Bottom 0.254: v60.7,36.56 60.72,36.58 105.15,36.58 v112.52,29.21 | v126.9,22.1 126.9,9.35 BACKPLANE.10
C2_1  (via drill 0.35)
  Top 0.254: BACKPLANE.12 119.1,7.85 125.73,14.48 v125.73,15.75 | v126.49,24.64 126.49,25.15 125.98,25.65 125.98,28.45 123.19,31.24 BRICKS1.04
  Bottom 0.254: v125.73,15.75 125.73,22.35 126.49,23.11 v126.49,24.64
C2_2  (via drill 0.35)
  Top 0.254: v46.99,29.72 49.02,29.72 54.9,35.6 v60.78,35.6 | v111.25,29.21 111.76,28.7 v111.76,22.61
  Bottom 0.254: BRICKS2.04 46.99,29.78 v46.99,29.72 | v60.78,35.6 61,35.81 104.65,35.81 v111.25,29.21 | v111.76,22.61 111.76,14.73 116.56,9.93 BACKPLANE.13
CLK  (via drill 0.35)
  Top 0.254: BACKPLANE.11 122.4,6.63 127.2,11.43 R13.1 | v60.76,37.67 51.38,37.67 46.23,32.51 44.26,32.51 BRICKS2.03 | BRICKS1.03 120.46,29.97 122.8,29.97 125.4,27.37 v125.4,23.34
  Bottom 0.254: BACKPLANE.11 120.42,6.63 120.22,6.83 120.22,7.09 120.5,7.37 121.41,7.37 121.67,7.62 121.67,7.87 121.41,8.13 119.76,8.13 119.51,8.38 119.51,8.76 119.63,8.89 121.41,8.89 121.67,9.14 121.67,9.4 121.92,9.65 122.94,9.65 124.89,11.61 124.89,22.84 v125.4,23.34 | v60.76,37.67 77.8,37.67 77.98,37.49 77.98,37.22 78.11,37.09 78.24,37.09 78.38,37.24 78.38,38 78.51,38.12 78.72,38.12 78.84,38 78.84,37.24 78.99,37.08 79.2,37.08 79.35,37.24 79.35,37.97 79.48,38.1 79.7,38.1 79.83,37.97 79.83,37.24 80.01,37.07 80.16,37.07 80.31,37.22 80.31,37.95 80.47,38.1 80.62,38.1 80.77,37.95 80.77,37.19 80.89,37.07 81.11,37.07 81.23,37.19 81.23,38 81.38,38.15 81.56,38.15 81.74,37.97 81.74,37.64 81.86,37.52 105.49,37.52 113.11,29.9 117.78,29.9 119.13,31.24 BRICKS1.03
CUTOUT
  cutout Bottom: 36.32,22.35 36.32,16 47.5,16 47.5,22.1 47.24,22.35
  cutout Top: 36.58,50.8 36.58,45.97 37.34,45.21 46.23,45.21 47.24,46.23 47.24,50.29 45.97,51.56 37.59,51.56 36.83,50.8
  cutout Bottom: 37.59,44.96 36.32,43.69 36.32,39.37 36.83,38.86 47.5,38.86 47.5,44.2 46.74,44.96
  cutout Bottom: 50.04,8.64 50.04,1.02 75.95,1.02 75.95,8.64
  cutout Bottom: 111.76,22.35 111.76,16.51 123.19,16.51 123.19,22.35
  cutout Top: 112.27,27.94 112.27,22.35 123.09,22.35 123.09,26.87 122.02,27.94
  cutout Top: 112.52,51.31 112.52,46.74 113.79,45.47 122.17,45.47 123.19,46.48 123.19,50.55 122.17,51.56 112.78,51.56
  cutout Bottom: 113.03,45.21 112.52,44.7 112.52,39.88 113.03,39.37 122.43,39.37 122.94,39.88 122.94,44.45 122.17,45.21
  cutout Bottom: 42.16,73.15 42.16,65.79 43.18,65.79 59.94,65.79 59.94,67.56 59.94,73.15 59.44,73.15
  cutout Bottom: 23.37,73.15 23.37,65.53 24.13,65.53 40.64,65.53 40.89,65.53 40.89,73.15 23.37,72.9
  cutout Top: 36.07,28.96 36.07,23.37 36.83,22.61 47.24,22.61 47.5,22.86 47.5,28.19 46.48,29.21 36.32,29.21
  cutout Top: 76.5,8.69 76.5,1.47 76.96,1.02 100.84,1.02 101.6,1.78 101.6,7.87 100.33,9.14 76.96,9.14
D_GND
  Bottom 0.762: 132.27,1.42 145.21,14.36 U$1.9
  Bottom 0.813: BACKPLANE.06 BACKPLANE.05 121.77,1.42 132.27,1.42 | U$1.10 U$1.9
DATA  (via drill 0.35)
  Top 0.254: BACKPLANE.08 130.02,6.63 132.06,8.66 132.06,15.08 R10.1 | BRICKS2.01 39.12,32.45 39.12,34.04 40.13,35.05 46.48,35.05 50.04,38.61 v60.76,38.61 | v127.99,26.67 127.99,29.31 122.07,35.23 115.75,35.23 115.32,34.8 115.32,31.75 114.81,31.24 BRICKS1.01
  Bottom 0.254: BACKPLANE.08 129.03,6.86 129.03,25.63 v127.99,26.67 | BRICKS1.01 113.54,31.24 106.17,38.61 v60.76,38.61
GND_RAW
  pour Top (isolate 0.254): 43.18,75.18 43.18,61.72 76.45,61.72 76.96,62.23 76.96,75.18 73.91,78.23 46.23,78.23
LED_DRIVE_A
  Top 0.61: D9.A 92.67,52.07 92.02,51.42 R7.2 89.76,50.66 88.16,49.06 Q6.1
LED_DRIVE_B  (via drill 0.35)
  Top 0.406: v65.91,50.72 65.92,50.74 R9.2 67.03,51.5 67.37,51.84 v68.45,51.84 | v71.63,51.82 72.08,51.82 72.46,52.2 D10.A | v63.22,47.98 v63.21,47.97 Q8.1
  Bottom 0.406: v71.63,51.82 71.6,51.82 71.58,51.84 v68.45,51.84 | v63.22,47.98 63.22,48.03 v65.91,50.72
N$1
  pour Top (isolate 0.508): 80.01,66.8 80.01,64.26 80.77,63.5 87.12,63.5 87.63,64.01 87.63,67.31 87.38,67.56 86.36,67.56 86.11,67.31 80.52,67.31
N$2
  Top 0.61: D5.A 13.56,40.52 D4.C 13.56,43.05 15.74,45.23 Q1.1
N$3
  Top 0.61: R4.1 84.84,45.55 85.17,45.89 Q6.2
N$4
  Top 0.61: D3.A 7.19,35.12 8.2,34.1 8.2,34.11 D2.C
N$5
  Top 0.61: Q5.3 100.33,49.11 99.91,49.53 R6.2 98.64,50.85 97.42,52.07 D9.C
N$6
  Top 0.305: 15.99,34.11 R2.2
  Top 0.61: 15.99,34.11 D2.A 13.54,34.11 13.57,34.14 D4.A
N$7
  Top 0.406: R5.1 63.18,44.94 Q8.2
N$11
  Top 0.406: Q7.3 78.74,49.13 78.34,49.53 R8.2 77.09,49.57 77.09,50.77 75.67,52.2 D10.C
N$13
  Top 0.61: D7.C 87,43.56 86.36,42.93 85,42.93 R4.2
N$15
  Top 0.406: R5.2 63.02,43.24 D8.C
ON/OFF  (via drill 0.35)
  Top 0.203: v23.62,33.78 23.62,38.61 37.77,52.76 v37.77,52.83 | v105.66,41.15 105.66,37.59 109.47,33.78 BRICKS1.05 | v92.71,53.34 91.95,54.1 v85.85,54.1 | v71.32,54.03 v61.95,54.03
  Bottom 0.203: v61.95,54.03 38.96,54.03 v37.77,52.83 | v105.66,41.15 93.47,53.34 v92.71,53.34 | v85.85,54.1 85.85,54.03 v71.32,54.03
  Bottom 0.254: v23.62,33.78 27.43,29.97 34.29,29.97 37.91,33.59 BRICKS2.05
  pour Top (isolate 0.508): 17.53,45.72 17.53,35.76 20.98,32.31 30.48,32.31 30.48,45.72
OR_DRIVE_A
  Top 0.61: U1.5 96.11,42.06 96.52,41.66 | Q3.1 96.52,41.66 | Q5.1 99.38,42.23 98.81,41.66 96.52,41.66
OR_DRIVE_B  (via drill 0.35)
  Top 0.406: v74.91,41.99 74.8,41.99 Q4.1 72.39,41.4 72.14,41.66 71.37,41.66 71.12,41.91 U2.5 | Q7.1 77.79,44.87 v77.5,44.58
  Bottom 0.406: v74.91,41.99 v77.5,44.58

### Text on the board
tNames: ROV X14 Distribution v1 / Raghav Kumar / Erin Park / Read Hedl / 1/8/22 | +12V | 12V_GND